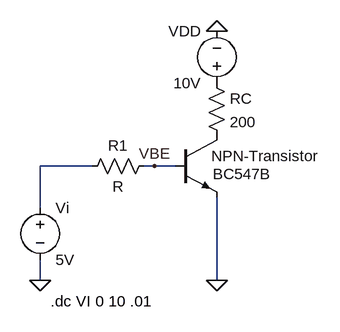
[diagram p0: schematic 2_2_1_c.asc]
2_2_1_c.asc, the LTspice schematic file:
Version 4
SHEET 1 880 680
WIRE 112 80 32 80
WIRE 208 80 192 80
WIRE 240 80 208 80
WIRE 32 144 32 80
WIRE 32 256 32 224
WIRE 304 256 304 128
FLAG 304 256 0
FLAG 32 256 0
FLAG 304 -128 0
FLAG 208 80 VBE
SYMBOL voltage 32 128 R0
SYMATTR InstName Vi
SYMATTR Value 5V
SYMBOL npn 240 32 R0
WINDOW 3 58 60 Left 2
SYMATTR Value BC547B
SYMATTR InstName NPN-Transistor
SYMBOL res 288 -64 R0
SYMATTR InstName RC
SYMATTR Value 200
SYMBOL voltage 304 -32 R180
WINDOW 0 24 96 Left 2
WINDOW 3 24 16 Left 2
SYMATTR InstName VDD
SYMATTR Value 10V
SYMBOL res 96 96 R270
WINDOW 0 32 56 VTop 2
WINDOW 3 0 56 VBottom 2
SYMATTR InstName R1
TEXT 48 288 Left 2 !.dc VI 0 10 .01

The netlist it stands for:
* 2_2_1_c.asc
Vi N001 0 5V
Q§NPN-Transistor P001 VBE 0 0 BC547B
RC P002 P001 200
VDD P002 0 10V
R1 N001 VBE R
.model NPN NPN
.model PNP PNP
.lib standard.bjt
.dc VI 0 10 .01
.backanno
.end